# Altium project lab2.PrjPcb
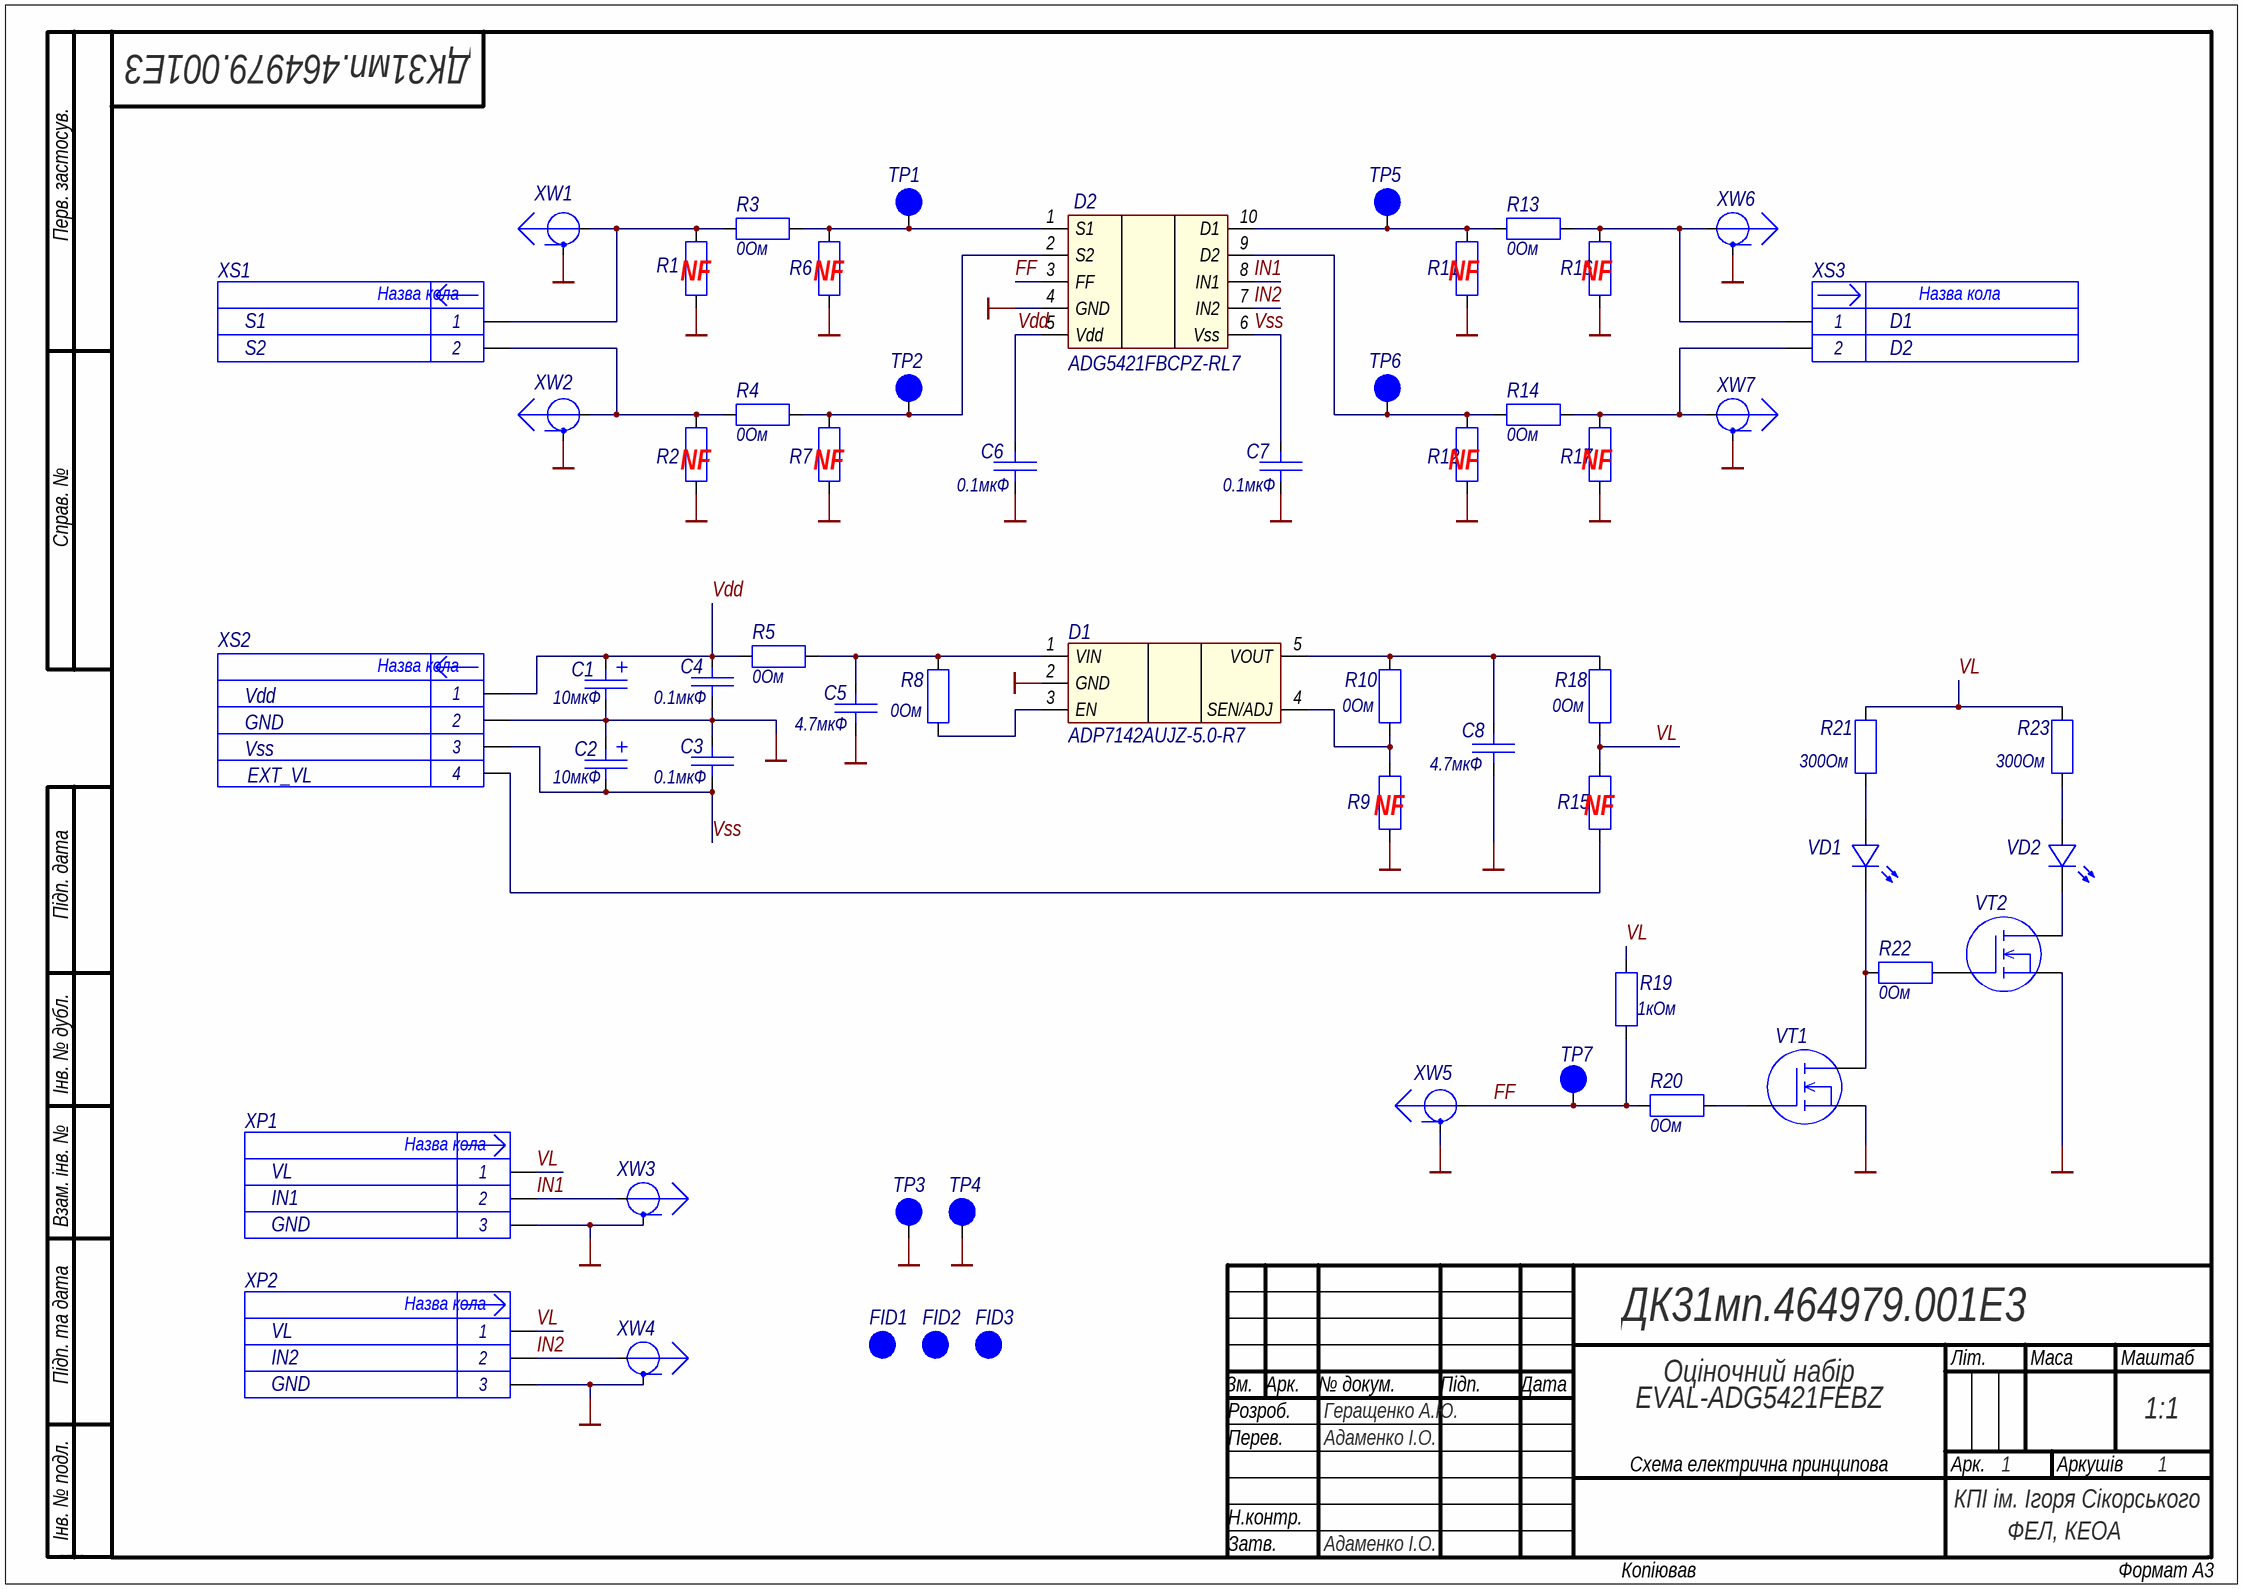
[diagram p0: Sheet1.SchDoc]
Вид_документа: Схема електрична принципова; Вид_документа_SCH: Схема електрична принципова; Наименование: Оціночний набір EVAL-ADG5421FEBZ; Наименование1: Оціночний набір; Наименование2: EVAL-ADG5421FEBZ; Обозначение: ДК31мп.464979.001Е3; Обозначение_Код: ДК31мп.464979.001Е3; п_Пров_Р: Адаменко І.О.; п_Разраб_Р: Геращенко А.Ю.; п_Утв_Р: Адаменко І.О.
1 sheet, 59 parts. Net scope: global (net labels, ports and power ports of the same name join across sheets).
Board file: PCB1.PcbDoc

## Sheet Sheet1.SchDoc: Схема електрична принципова
size 420 x 297 mm; Organization: ФЕЛ, КЕОА; SheetNumber: 1; SheetTotal: 1

### Parts
C1  value 10мкФ  [CAP_TANT_10uF]  (hidden comment: CAP_TANT_10uF)
C2  value 10мкФ  [CAP_TANT_10uF]  (hidden comment: CAP_TANT_10uF)
C3  value 0.1мкФ  [CAP_0603_0.1uF]  (hidden comment: CAP_0603_0.1uF)
C4  value 0.1мкФ  [CAP_0603_0.1uF]  (hidden comment: CAP_0603_0.1uF)
C5  value 4.7мкФ  [CAP_0805_4.7uF]  (hidden comment: CAP_0805_4.7uF)
C6  value 0.1мкФ  [CAP_0603_0.1uF]  (hidden comment: CAP_0603_0.1uF)
C7  value 0.1мкФ  [CAP_0603_0.1uF]  (hidden comment: CAP_0603_0.1uF)
C8  value 4.7мкФ  [CAP_0805_4.7uF]  (hidden comment: CAP_0805_4.7uF)
D1  ADP7142AUJZ-5.0-R7  [ADP7142AUJZ-5.0-R7]
D2  ADG5421FBCPZ-RL7  [ADG5421FBCPZ-RL7]
FID1  Fiducial  [FIDUCIAL 1mm]  (value not drawn)  (no BOM)
FID2  Fiducial  [FIDUCIAL 1mm]  (value not drawn)  (no BOM)
FID3  Fiducial  [FIDUCIAL 1mm]  (value not drawn)  (no BOM)
R1  RES_0603 0Ohm  [RES_0603 0Ohm]  (value not drawn)
R2  RES_0603 0Ohm  [RES_0603 0Ohm]  (value not drawn)
R3  value 0Ом  [RES_0603 0Ohm]  (hidden comment: RES_0603 0Ohm)
R4  value 0Ом  [RES_0603 0Ohm]  (hidden comment: RES_0603 0Ohm)
R5  value 0Ом  [RES_0805 0Ohm]  (hidden comment: RES_0805 0Ohm)
R6  RES_0603 0Ohm  [RES_0603 0Ohm]  (value not drawn)
R7  RES_0603 0Ohm  [RES_0603 0Ohm]  (value not drawn)
R8  value 0Ом  [RES_0603 0Ohm]  (hidden comment: RES_0603 0Ohm)
R9  RES_0603 0Ohm  [RES_0603 0Ohm]  (value not drawn)
R10  value 0Ом  [RES_0603 0Ohm]  (hidden comment: RES_0603 0Ohm)
R11  RES_0603 0Ohm  [RES_0603 0Ohm]  (value not drawn)
R12  RES_0603 0Ohm  [RES_0603 0Ohm]  (value not drawn)
R13  value 0Ом  [RES_0603 0Ohm]  (hidden comment: RES_0603 0Ohm)
R14  value 0Ом  [RES_0603 0Ohm]  (hidden comment: RES_0603 0Ohm)
R15  RES_0805 0Ohm  [RES_0805 0Ohm]  (value not drawn)
R16  RES_0603 0Ohm  [RES_0603 0Ohm]  (value not drawn)
R17  RES_0603 0Ohm  [RES_0603 0Ohm]  (value not drawn)
R18  value 0Ом  [RES_0805 0Ohm]  (hidden comment: RES_0805 0Ohm)
R19  value 1кОм  [RES_0603 1kOhm]  (hidden comment: RES_0603 1kOhm)
R20  value 0Ом  [RES_0603 0Ohm]  (hidden comment: RES_0603 0Ohm)
R21  value 300Ом  [RES_0805 300Ohm]  (hidden comment: RES_0805 300Ohm)
R22  value 0Ом  [RES_0603 0Ohm]  (hidden comment: RES_0603 0Ohm)
R23  value 300Ом  [RES_0805 300Ohm]  (hidden comment: RES_0805 300Ohm)
TP1  Test point  [TEST POINT RED]  (value not drawn)  (no BOM)
TP2  Test point  [TEST POINT RED]  (value not drawn)  (no BOM)
TP3  Test point  [TEST POINT BLACK]  (value not drawn)  (no BOM)
TP4  Test point  [TEST POINT BLACK]  (value not drawn)  (no BOM)
TP5  Test point  [TEST POINT RED]  (value not drawn)  (no BOM)
TP6  Test point  [TEST POINT RED]  (value not drawn)  (no BOM)
TP7  Test point  [TEST POINT RED]  (value not drawn)  (no BOM)
VD1  KP-2012SGC GREEN  [KP-2012SGC GREEN]  (value not drawn)
VD2  KP-2012EC RED  [KP-2012EC RED]  (value not drawn)
VT1  NDS7002A onsemi  [NDS7002A]  (value not drawn)
VT2  NDS7002A onsemi  [NDS7002A]  (value not drawn)
XP1  M20-9990345  [M20-9990345]  (value not drawn)
XP2  M20-9990345  [M20-9990345]  (value not drawn)
XS1  CTB5000/2  [CTB5000/2]  (value not drawn)
XS2  CTB5000/4  [CTB5000/4]  (value not drawn)
XS3  CTB5000/2  [CTB5000/2]  (value not drawn)
XW1  SMB1251B1-3GT30G-50  [SMB1251B1-3GT30G-50]  (value not drawn)
XW2  SMB1251B1-3GT30G-50  [SMB1251B1-3GT30G-50]  (value not drawn)
XW3  SMB1251B1-3GT30G-50  [SMB1251B1-3GT30G-50]  (value not drawn)
XW4  SMB1251B1-3GT30G-50  [SMB1251B1-3GT30G-50]  (value not drawn)
XW5  SMB1251B1-3GT30G-50  [SMB1251B1-3GT30G-50]  (value not drawn)
XW6  SMB1251B1-3GT30G-50  [SMB1251B1-3GT30G-50]  (value not drawn)
XW7  SMB1251B1-3GT30G-50  [SMB1251B1-3GT30G-50]  (value not drawn)

### Nets
GND: C1.2 C2.1 C3.2 C4.1 C5.1 C6.1 C7.1 C8.1 D1.2(GND) D2.4(GND) R1.1 R2.1 R6.1 R7.2 R9.1 R11.1 R12.2 R16.1 R17.1 TP3.1 TP4.1 VT1.2 VT2.2 XP1.3 XP2.3 XS2.2 XW1.2 XW2.2 XW3.2 XW4.2 XW5.2 XW6.2 XW7.2
FF: D2.3(FF) R19.1 R20.1 TP7.1 XW5.1
IN1: D2.8(IN1) XP1.2 XW3.1
IN2: D2.7(IN2) XP2.2 XW4.1
Vdd: C1.1 C4.2 C6.2 D2.5(Vdd) R5.1 XS2.1
VL: R15.2 R18.1 R19.2 R21.2 R23.2 XP1.1 XP2.1
Vss: C2.2 C3.1 C7.2 D2.6(Vss) XS2.3
NetC5_2: C5.2 D1.1(VIN) R5.2 R8.2
NetC8_2: C8.2 D1.5(VOUT) R10.2 R18.2
NetD1_3: D1.3(EN) R8.1
NetD1_4: D1.4(SEN/ADJ) R9.2 R10.1
NetD2_1: D2.1(S1) R3.1 R6.2 TP1.1
NetD2_2: D2.2(S2) R4.1 R7.1 TP2.1
NetD2_9: D2.9(D2) R12.1 R14.1 TP6.1
NetD2_10: D2.10(D1) R11.2 R13.1 TP5.1
NetR1_2: R1.2 R3.2 XS1.2 XW1.1
NetR2_2: R2.2 R4.2 XS1.1 XW2.1
NetR13_2: R13.2 R16.2 XS3.1 XW6.1
NetR14_2: R14.2 R17.2 XS3.2 XW7.1
NetR15_1: R15.1 XS2.4
NetR20_2: R20.2 VT1.1
NetR21_1: R21.1 VD1.1
NetR22_1: R22.1 VD1.2 VT1.3
NetR22_2: R22.2 VT2.1
NetR23_1: R23.1 VD2.1
NetVD2_2: VD2.2 VT2.3

### Notes on the sheet
- S1
- (near R1) NF
- (near R6) NF
- (near R11) NF
- (near R16) NF
- D1
- S2
- D2
- (near R2) NF
- (near R7) NF
- (near R12) NF
- (near R17) NF
- Vdd
- GND
- Vss
- EXT_VL
- (near R9) NF
- (near R15) NF
- VL
- IN1
- IN2
- Перв. застосув.
- Справ. №
- Підп. дата
- Інв. № дубл.
- Взам. інв. №
- Підп. та дата
- Зм.
- Розроб.
- Арк.
- № докум.
- Підп.
- Дата
- Літ.
- Маса
- Маштаб
- 1:1
- Перев.
- Аркушів
- Інв. № подл.
- Н.контр.
- Затв.
- КПІ ім. Ігоря Сікорського
- ALTIUM GOSTBOM2.0 KEV
- Копіював
- Формат А3
- (in symbol CTB5000/2) Назва кола
- (in symbol CTB5000/4) Назва кола
- (in symbol M20-9990345) Назва кола

### Library data of the parts
C1 C2 = CAP_TANT_10uF: CAP TANT 10UF 10% 50V 2917; Manufacturer: KYOCERA AVX; Part Number: 478-2380-6-ND; Voltage: 50В; Type: Конденсатор танталовий; Package: 2917; Tolerance: ±10%; Mount: SMT; Dielectric: *; Min Operating Temperature: -55; Max Operating Temperature: 125; Number of Pins: 2
C3 C4 C6 C7 = CAP_0603_0.1uF: CAP CER 0.1UF 50V X7R 0603; Manufacturer: Murata Electronics; Part Number: 490-1519-6-ND; Tolerance: ±10%; Voltage: 50В; Type: Конденсатор керамічний; Package: 0603; Mount: SMT; Dielectric: X7R; Min Operating Temperature: -55; Max Operating Temperature: 125; Number of Pins: 2
C5 C8 = CAP_0805_4.7uF: CAP CER 4.7UF 50V X5R 0805; Manufacturer: TDK Corporation; Part Number: 445-5980-6-ND; Tolerance: ±10%; Voltage: 50В; Type: Конденсатор керамічний; Package: 0805; Mount: SMT; Dielectric: X5R; Min Operating Temperature: -55; Max Operating Temperature: 85; Number of Pins: 2
D1 = ADP7142AUJZ-5.0-R7: IC REG LINEAR 5V 200MA TSOT23-5; Manufacturer: Analog Devices Inc.; Part Number: 505-ADP7142AUJZ-5.0-R7DKR-ND; Package: SOT-23-5 Thin, TSOT-23-5; Mount: SMT; Type: *; Min Operating Temperature: -40°C; Max Operating Temperature: +125°C; Number of Pins: 5
D2 = ADG5421FBCPZ-RL7: IC SW SPST-NCX2 14OHM 10LFCSP; Manufacturer: Analog Devices Inc.; Part Number: 505-ADG5421FBCPZ-RL7DKR-ND; Package: 10-WFDFN, CSP; Mount: SMT; Type: *; Min Operating Temperature: -40°C; Max Operating Temperature: +125°C; Number of Pins: 10
FID1-FID3 = FIDUCIAL 1mm: Fiducial 1mm Pad; Value: Fiducial; Component Function: *
R1 R2 R6 R7 R9 R11 R12 R16 R17 = RES_0603 0Ohm: RES 0 OHM 63mW 0603; Manufacturer: Multicomp; Part Number: MC0603WG00000T5E-TC; Value: 0Ом; Power Rating: 63 мВт; Package: 0603; Tolerance: *; Type: Резистор; Mount: SMT; Min Operating Temperature: -55°C; Max Operating Temperature: +155°C; Number of Pins: 2
R3 R4 R8 R10 R13 R14 R20 R22 = RES_0603 0Ohm: RES 0 OHM 63mW 0603; Manufacturer: Multicomp; Part Number: MC0603WG00000T5E-TC; Power Rating: 63 мВт; Package: 0603; Tolerance: *; Type: Резистор; Mount: SMT; Min Operating Temperature: -55°C; Max Operating Temperature: +155°C; Number of Pins: 2
R5 R18 = RES_0805 0Ohm: RES SMD 0 OHM JUMPER 1/8W 0805; Manufacturer: Panasonic Electronic Components; Part Number: ERJ-6GEY0R00V; Package: 0805; Tolerance: *; Power Rating: *; Type: Резистор; Mount: SMT; Min Operating Temperature: -55°C; Max Operating Temperature: +155°C; Number of Pins: 2
R15 = RES_0805 0Ohm: RES SMD 0 OHM JUMPER 1/8W 0805; Manufacturer: Panasonic Electronic Components; Part Number: ERJ-6GEY0R00V; Value: 0Ом; Package: 0805; Tolerance: *; Power Rating: *; Type: Резистор; Mount: SMT; Min Operating Temperature: -55°C; Max Operating Temperature: +155°C; Number of Pins: 2
R19 = RES_0603 1kOhm: RES 1K OHM 1% 63mW 0603; Manufacturer: Multicomp; Part Number: MC0063W060311K; Power Rating: 63 мВт; Package: 0603; Tolerance: ±1%; Type: Резистор; Mount: SMT; Min Operating Temperature: -55°C; Max Operating Temperature: +155°C; Number of Pins: 2
R21 R23 = RES_0805 300Ohm: RES 300 OHM 5% 1/8W 0805; Manufacturer: YAGEO; Part Number: 311-300ARDKR-ND; Package: 0805; Tolerance: ±5%; Power Rating: 1/8W; Type: Резистор; Mount: SMT; Min Operating Temperature: -55°C; Max Operating Temperature: +155°C; Number of Pins: 2
TP1 TP2 TP5-TP7 = TEST POINT RED: VERO 20-2137 / PCB Test Point, Red, Through Hole Mount, 1.02 mm, Phosphor Bronze; Value: Test point; Component Function: *
TP3 TP4 = TEST POINT BLACK: VERO 20-2137 / PCB Test Point, Black, Through Hole Mount, 1.02 mm, Phosphor Bronze; Value: Test point; Component Function: *
VD1 = KP-2012SGC GREEN: 2-pin, SMT LED, green, forward voltage 2.2V, forward current 20mA; Manufacturer: KINGBRIGHT; Min Opearing Temperature: -40°C; Max Opearing Temperature: +85°C; Part Number: KP-2012SGC; Number of Pins: 2; Mated With: *; Type: LED
VD2 = KP-2012EC RED: 2-pin, SMT LED, red, forward voltage 2V, forward current 20mA; Manufacturer: KINGBRIGHT; Min Opearing Temperature: -40°C; Max Opearing Temperature: +85°C; Part Number: KP-2012EC; Number of Pins: 2; Mated With: *; Type: LED
VT1 VT2 = NDS7002A: MOSFET N-CH 60V 280MA SOT-23; Name: NDS7002A; Manufacturer: onsemi
XP1 XP2 = M20-9990345: CONN HEADER VERT 3POS 2.54MM; Manufacturer: Harwin Inc.; Part Number: 952-2263-ND; Min Opearing Temperature: -40°C; Max Opearing Temperature: +105°C; Number of Pins: 3; Mated With: *; Type: Male
XS1 XS3 = CTB5000/2: 2-pin, terminal blocks (5 mm pitch), 250V, 16A; Manufacturer: CAMDENBOSS; Min Opearing Temperature: -25°C; Max Opearing Temperature: +110°C; Part Number: CTB5000/2; Number of Pins: 2; Mated With: *; Type: Female
XS2 = CTB5000/4: 4-pin, terminal blocks (5 mm pitch), 250V, 16A; Manufacturer: CAMDENBOSS; Min Opearing Temperature: -25°C; Max Opearing Temperature: +110°C; Part Number: CTB5000/4; Number of Pins: 4; Mated With: *; Type: Female
XW1-XW7 = SMB1251B1-3GT30G-50: 50 Ω, SMB connectors; Manufacturer: AMPHENOL RF; Part Number: SMB1251B1-3GT30G-50; Number of Pins: 2; Mount: THT; Min Operating Temperature: -40°C; Max Operating Temperature: +85°C; Mated With: *; Type: Male Socket